# EAGLE schematic PressureSensors (EAGLE 9.0.1)
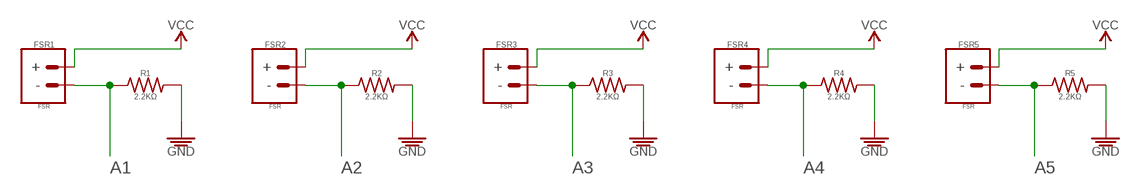
[diagram p0: schematic, sheet 1]

## Parts
FSR1  FSR  FSR_FORCE-SENSATIVE-RESISTOR_PRESS-SENSOR  [CONNECTOR_FSR]
FSR2  FSR  FSR_FORCE-SENSATIVE-RESISTOR_PRESS-SENSOR  [CONNECTOR_FSR]
FSR3  FSR  FSR_FORCE-SENSATIVE-RESISTOR_PRESS-SENSOR  [CONNECTOR_FSR]
FSR4  FSR  FSR_FORCE-SENSATIVE-RESISTOR_PRESS-SENSOR  [CONNECTOR_FSR]
FSR5  FSR  FSR_FORCE-SENSATIVE-RESISTOR_PRESS-SENSOR  [CONNECTOR_FSR]
R1  2.2KΩ  2.2KΩ_SMD-0805_1/8W-5%  [RESISTOR_SMD-805]
R2  2.2KΩ  2.2KΩ_SMD-0805_1/8W-5%  [RESISTOR_SMD-805]
R3  2.2KΩ  2.2KΩ_SMD-0805_1/8W-5%  [RESISTOR_SMD-805]
R4  2.2KΩ  2.2KΩ_SMD-0805_1/8W-5%  [RESISTOR_SMD-805]
R5  2.2KΩ  2.2KΩ_SMD-0805_1/8W-5%  [RESISTOR_SMD-805]

## Nets
A1: FSR1.- R1.1
A2: FSR2.- R2.1
A3: FSR3.- R3.1
A4: FSR4.- R4.1
A5: FSR5.- R5.1
GND: R1.2 R2.2 R3.2 R4.2 R5.2
VCC: FSR1.+ FSR2.+ FSR3.+ FSR4.+ FSR5.+

## Library data of the parts
FSR1-FSR5 = PiB:FSR_FORCE-SENSATIVE-RESISTOR_PRESS-SENSOR; CREATOR: MrSwirlyEyes; DATASHEET: http://www.interlinkelectronics.com/datasheets/Datasheet_FSR.pdf; DIST: Digikey; DISTLINK: https://www.digikey.com/products/en?keywords=1027-1014-ND; DISTPN: 1027-1014-ND; MFR: Interlink Electronics; MPN: 34-00004; QUERY: https://www.digikey.com/products/en/sensors-transducers/force-sensors/531?k=force+sensitive+resistor&k=&pkeyword=force+sensitive+resistor&pv1260=27&pv1260=26&pv1260=42&pv1260=20&pv1260=29&FV=ffe00213%2C884001a&mnonly=0&ColumnSort=0&page=1&quantity=0&ptm=0&fid=0&pageSize=250; TESTED: NO
R1-R5 = PiB_resistors:2.2KΩ; CREATOR: MrSwirlyEyes; DATASHEET: http://www.yageo.com/documents/recent/PYu-RC_Group_51_RoHS_L_7.pdf; DIST: Digikey; DISTLINK: https://www.digikey.com/product-detail/en/yageo/RC0805JR-072K2L/311-2.2KARCT-ND/731218; DISTPN: 311-2.2KARCT-ND; MFR: Yageo; MPN: RC0805JR-072K2L; TESTED: NO